# EasyEDA Pro project SMP_Project (2).eprj

# Schematic Schematic1
Board Name: Board1; Create Date: 2026-04-23; Page Name: P1; Project Name: SMP_Project; Schematic Name: Schematic1; Update Date: 2026-04-29; Company: EasyEDA.com; Page Size: A4; Version: V1.0
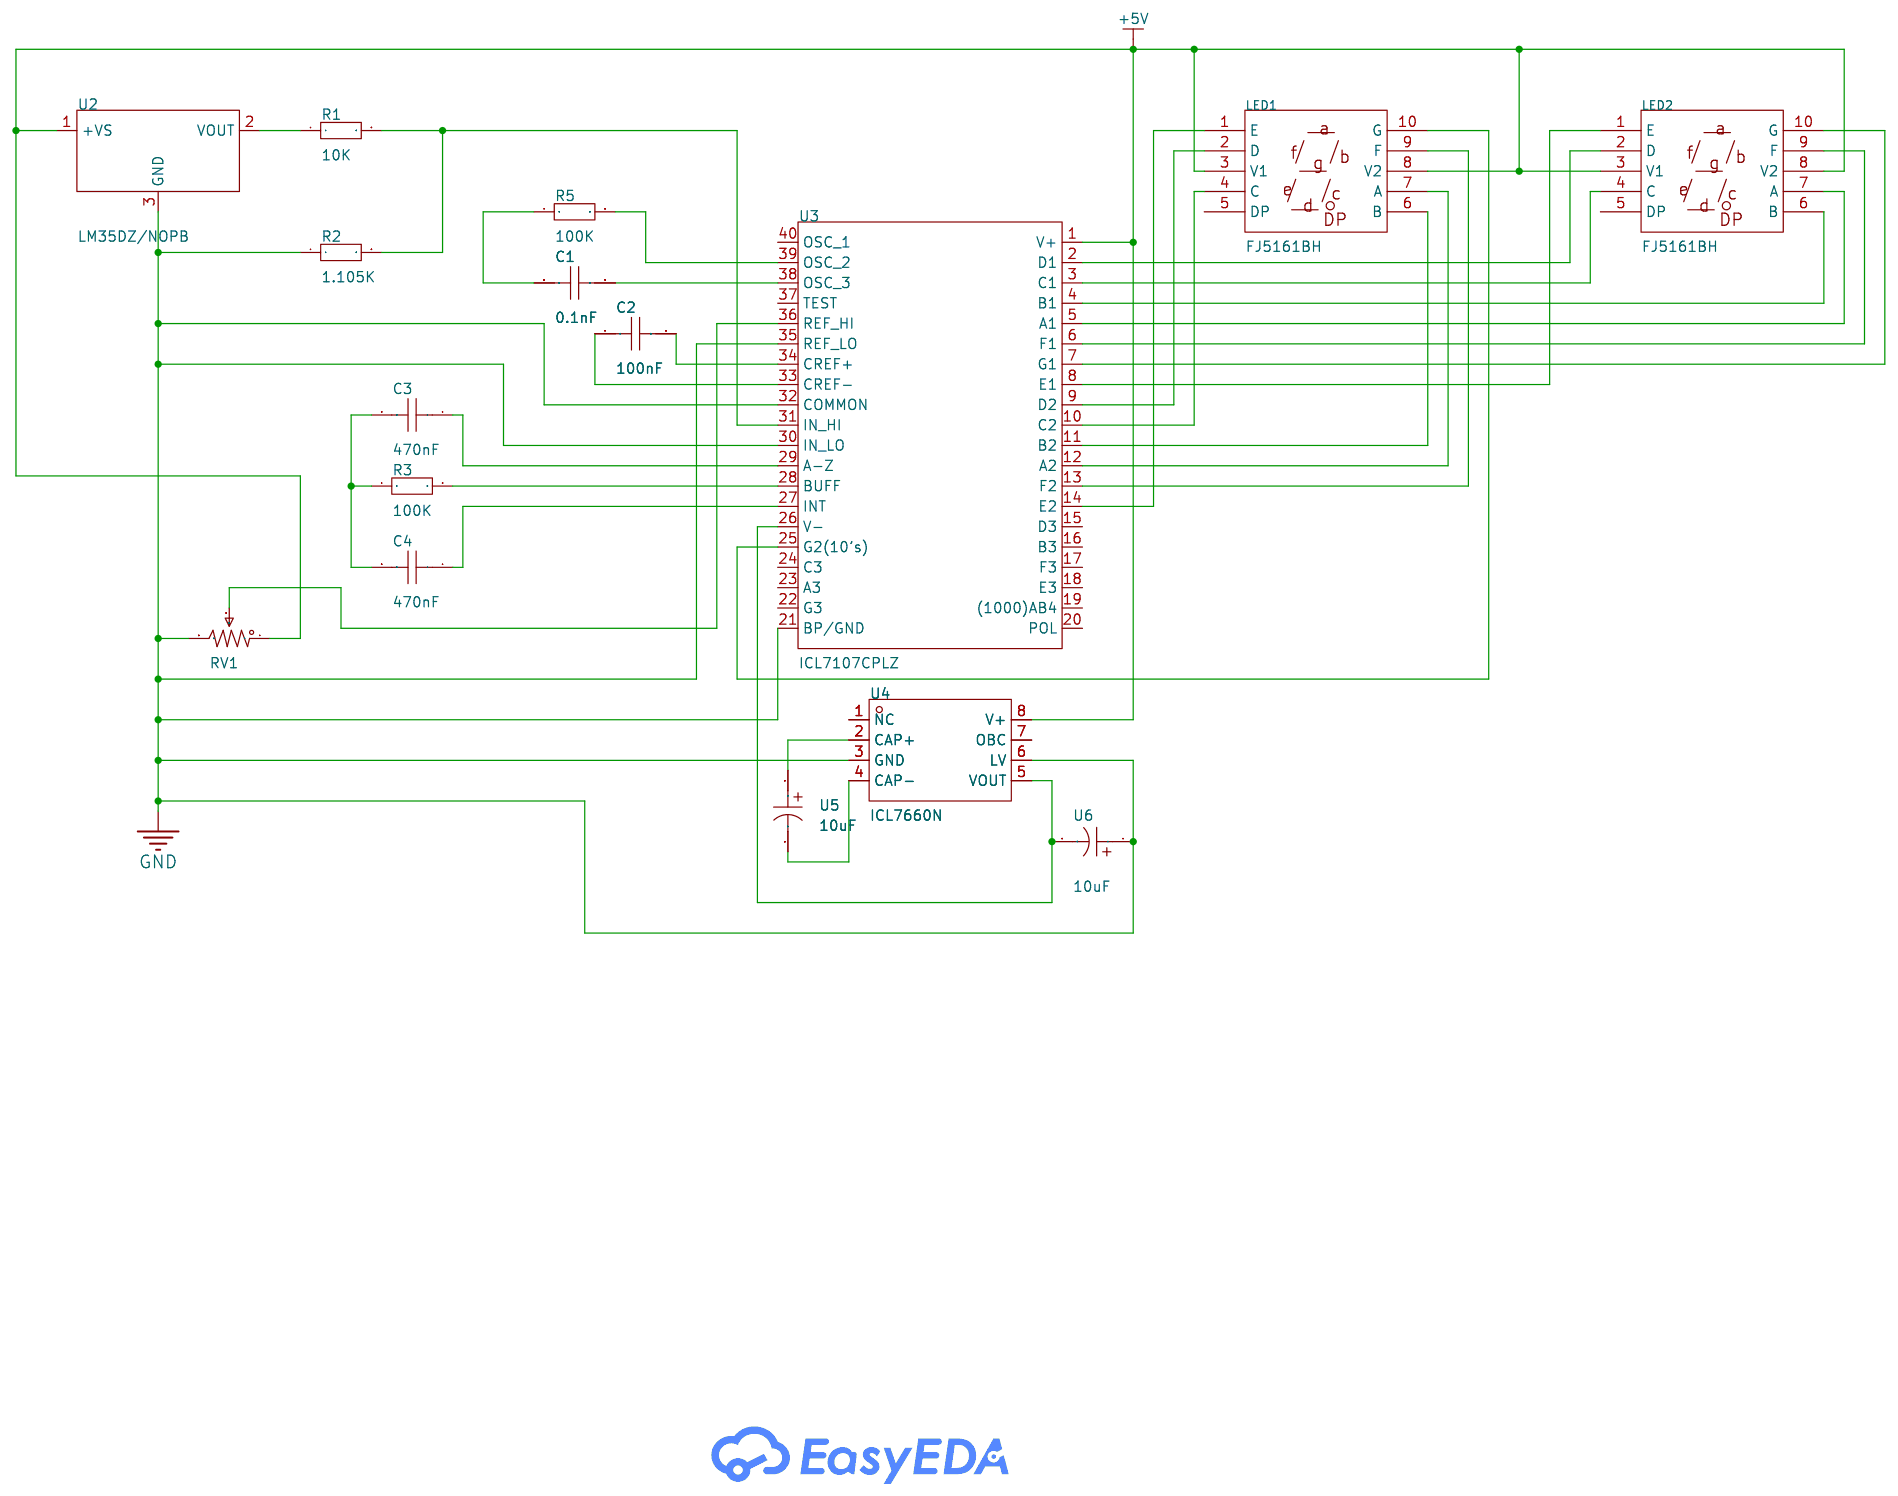
[diagram p0: schematic sheet]

## Parts
C1  0.1nF  [C0805]
C2  100nF  [C0805]
C3  470nF  [C0805]
C4  470nF  [C0805]
LED1  FJ5161BH  [LED-SEG-TH_FJ5161BH]
LED2  FJ5161BH  [LED-SEG-TH_FJ5161BH]
R1  10K  [R0805]
R2  1.105K  [R0805]
R3  100K  [R0805]
R5  100K  [R0805]
RV1  1kΩ  [RES-ADJ-TH_3P-L10.0-W10.0-P2.50-BL-BS]
U2  LM35DZ/NOPB  [TO-92-3_L4.9-W3.7-P1.27-L]
U3  ICL7107CPLZ  [DIP-40_L52.3-W13.9-P2.54-LS15.2-BL]
U4  ICL7660N  [DIP-8_L9.4-W6.4-P2.54-LS9.1-BL]
U5  10uF  [CAP-TH_BD10.0-P5.00-D0.6-FD]
U6  10uF  [CAP-TH_BD10.0-P5.00-D0.6-FD]

## Library data of the parts
C1-C4 = CAP_0805: Supplier Footprint: 0805
LED1 LED2 = FJ5161BH: LCSC Part Name: 1位0.56英寸红色数码管 共阳极; Supplier Part: C8092; Manufacturer: 志浩; Supplier Footprint: 插件; JLCPCB Part Class: Extended Part; Datasheet: https://item.szlcsc.com/datasheet/FJ5161BH/8574.html; Supplier: LCSC; Number of Characters: 1; Display Type: 7 Segment; Digit/Alpha Size(inch): 0.56; Illumination Color: Red; LED Polarity: Common Anode
R1-R3 R5 = Res_0805: Supplier Footprint: 0805
RV1 = 3296W-1-102: LCSC Part Name: 1kΩ ±10%; Supplier Part: C118949; Manufacturer: BOCHEN(博晨); Supplier Footprint: 插件-3P,9.5x4.9mm; JLCPCB Part Class: Extended Part; Datasheet: https://item.szlcsc.com/datasheet/3296W-1-102/120218.html; Supplier: LCSC; Tolerance: ±10%; Power(Watts): 500mW; Temperature Coefficient: ±250ppm/℃; Number of Turns: 30
U2 = LM35DZ/NOPB_C12165: LCSC Part Name: 精密摄氏温度传感器; Supplier Part: C12165; Manufacturer: TI(德州仪器); Supplier Footprint: TO-92; JLCPCB Part Class: Extended Part; Datasheet: https://www.ti.com/cn/lit/gpn/lm35; Supplier: LCSC; Detection Temperature Range: 0℃~+100℃; Tolerance: ±1.5℃; Voltage - Supply: 4V~30V
U3 = ICL7107CPLZ_C1520744: Supplier Part: C1520744; Manufacturer: RENESAS(瑞萨)/IDT; Supplier Footprint: PDIP-40; JLCPCB Part Class: Extended Part; Datasheet: https://item.szlcsc.com/datasheet/ICL7107CPLZ/1611542.html; Supplier: LCSC; Resolution (Bits): 3.5; Voltage - Supply: 6V; Operating Temperature: 0℃~+70℃; Voltage Reference: External；Built-in; Voltage Reference Drift: 1ppm/℃
U4 = ICL7660N: Supplier Part: C19193423; Manufacturer: HGSEMI(华冠); Supplier Footprint: DIP-8; JLCPCB Part Class: Extended Part; Datasheet: https://atta.szlcsc.com/upload/public/pdf/source/20231208/A47A2180530992FCCD2558815FF503B1.pdf; Supplier: LCSC
U5 U6 = 10uF_400V: Supplier Part: C9900016271; Supplier Footprint: Capacitor_THT:CP_Radial_D10.0mm_P5.00mm; JLCPCB Part Class: Extended Part; Supplier: LCSC

## Nets
+5V: LED1.3(V1) LED1.8(V2) LED2.3(V1) LED2.8(V2) RV1.1 U2.1(+VS) U3.1(V+) U4.8(V+)
GND: R2.1 RV1.3 U2.3(GND) U3.21(BP/GND) U3.30(IN LO) U3.32(COMMON) U3.35(REF LO) U4.3(GND) U4.6(LV) U6.1
$1N2817: R1.1 U2.2(VOUT)
$1N5957: R3.2 U3.28(BUFF)
$1N5960: C4.1 U3.27(INT)
$1N5964: C3.2 C4.2 R3.1
$1N6071: C3.1 U3.29(A-Z)
$1N6088: C2.2 U3.34(CREF+)
$1N6111: C2.1 U3.33(CREF-)
$1N6121: R5.2 U3.39(OSC 2)
$1N6127: C1.1 U3.38(OSC 3)
$1N6266: RV1.2 U3.36(REF HI)
$1N6322: LED2.6(B) U3.4(B1)
$1N6356: LED2.2(D) U3.2(D1)
$1N6383: LED2.1(E) U3.8(E1)
$1N6448: LED2.9(F) U3.6(F1)
$1N6454: LED2.10(G) U3.7(G1)
$1N6496: LED1.7(A) U3.12(A2)
$1N6502: LED1.6(B) U3.11(B2)
$1N6516: LED1.4(C) U3.10(C2)
$1N6550: LED1.2(D) U3.9(D2)
$1N6584: LED1.9(F) U3.13(F2)
$1N6616: LED1.1(E) U3.14(E2)
$1N6631: LED1.10(G) U3.25(G2(10’s))
$1N7255: R1.2 R2.2 U3.31(IN HI)
$1N8306: LED2.7(A) U3.5(A1)
$1N8331: LED2.4(C) U3.3(C1)
$1N8679: C1.2 R5.1
$1N8694: U3.26(V-) U4.5(VOUT) U6.2
$1N8864: U4.2(CAP+) U5.1
$1N8870: U4.4(CAP-) U5.2

Not connected (* = marked no-connect by the designer): LED1 5(DP); LED2 5(DP); U3 15(D3) 16(B3) 17(F3) 18(E3) 19((1000)AB4) 20(POL) 22(G3) 23(A3) 24(C3) 37(TEST) 40(OSC 1); U4 1(NC) 7(OBC)

# Board PCB1
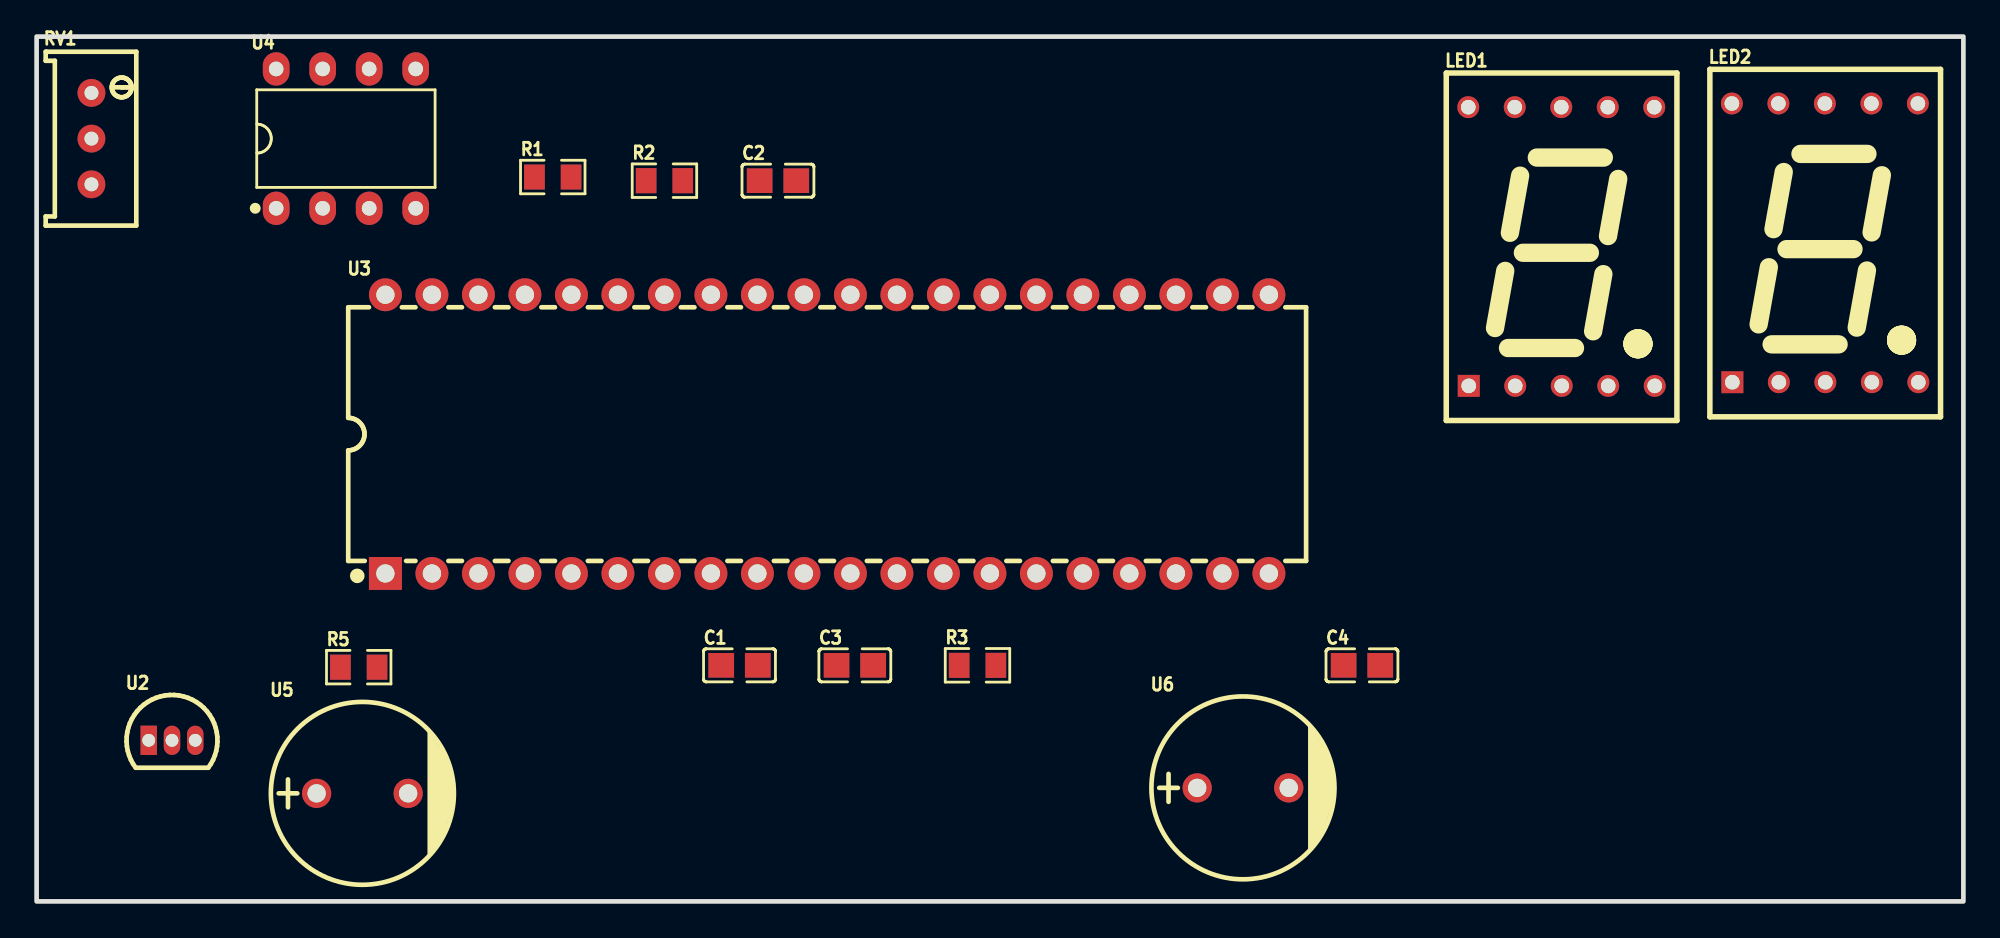
[diagram p1: board, top side]
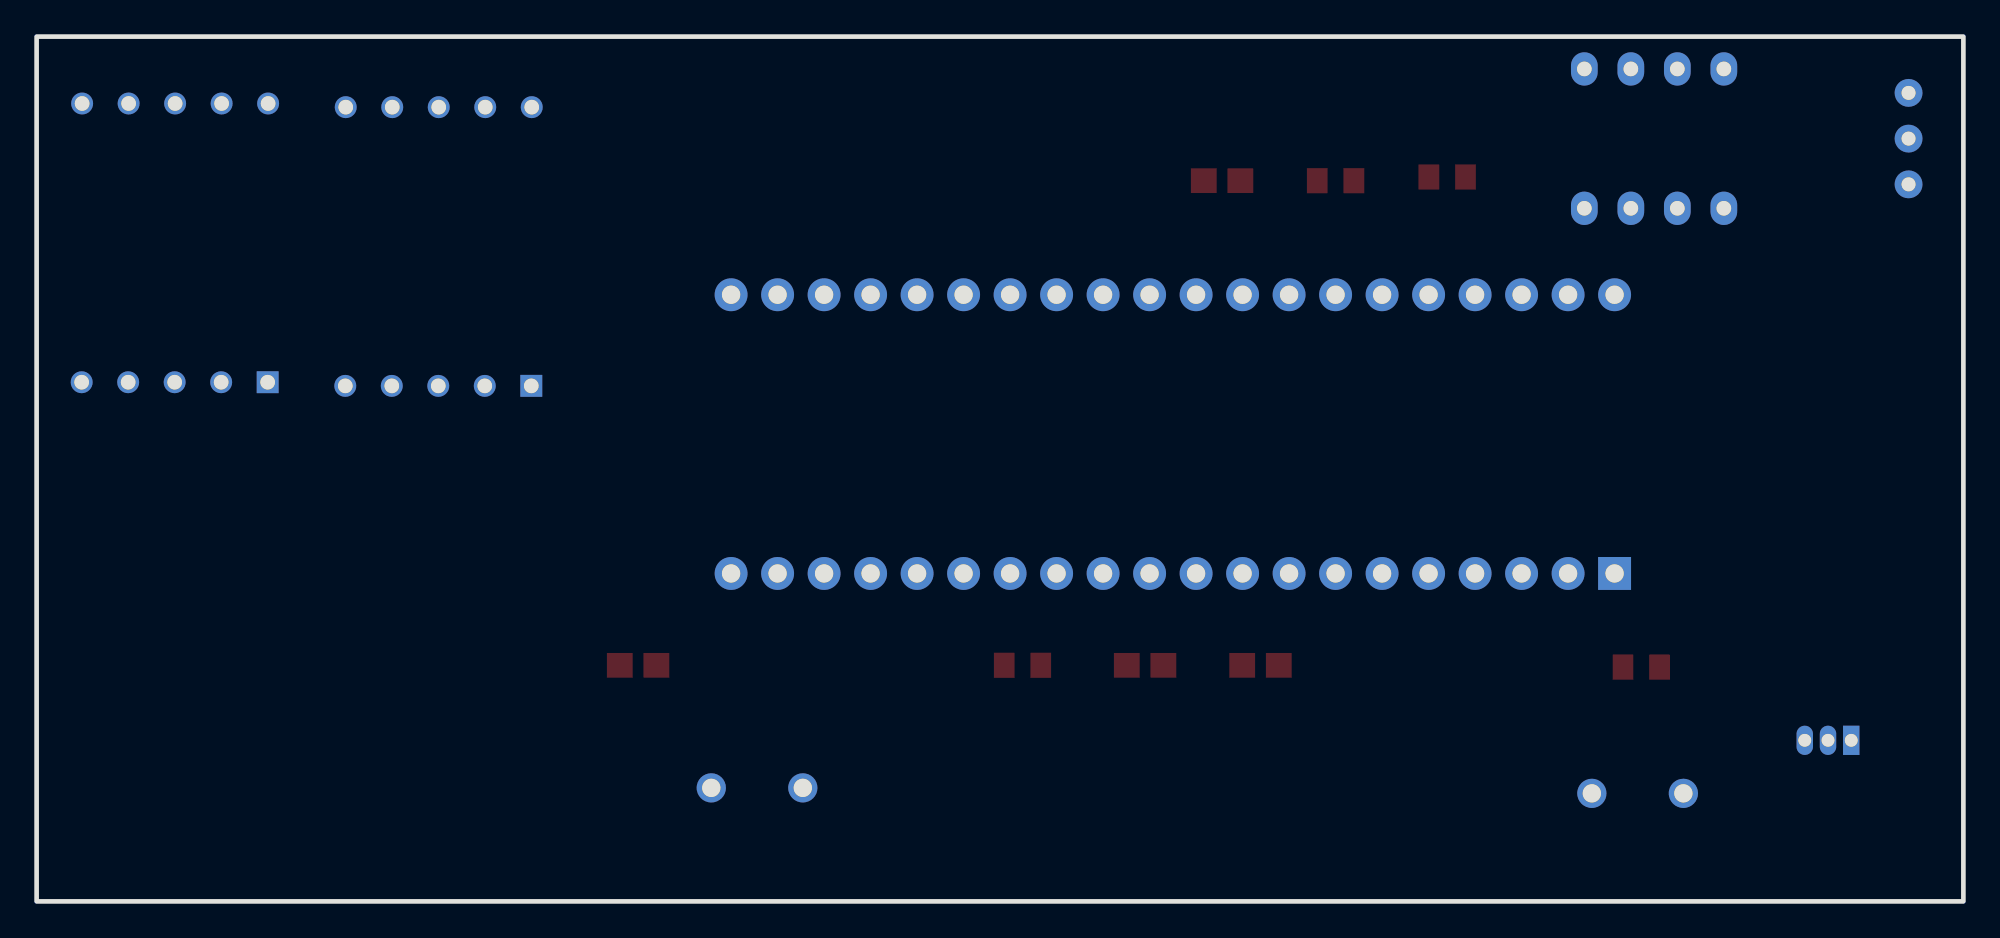
[diagram p2: board, bottom side, seen from below]

Outline 105.25 x 47.29 mm; copper layers: Top Layer, Bottom Layer. Coordinates in mm from the lower left corner of the outline.
Outline path: rectangle 0,47.29 105.25,0
Stack: Top Layer 0.035mm / Dielectric1 1.51mm FR4 er 4.5 / Bottom Layer 0.035mm

## Design rules (mm)
template: JLCPCB Capability(Two Layers Board)
spacing copperThickness1oz (default): track to track 0.102, other pairs 0.152 to 0.3
spacing copperThickness2oz: track to track 0.203, other pairs 0.152 to 0.3
track width copperThickness1oz (default): min 0.127, default 0.254, max 2.54
track width copperThickness2oz: min 0.203, default 0.254, max 2.54
differential pair differentialPair (default): width min 0.127, default 0.254, max 2.54; gap min 0.152, default 0.152
via viaSize (default): diameter min 0.5, default 0.61, max 10; hole min 0.3, default 0.305, max 6.3

## Placement (name value [footprint] x y rotation side)
C1  0.1nF  [C0805]  38.39 12.91 0 top
C2  100nF  [C0805]  40.49 39.41 0 top
C3  470nF  [C0805]  44.7 12.91 0 top
C4  470nF  [C0805]  72.39 12.91 0 top
LED1  FJ5161BH  [LED-SEG-TH_FJ5161BH]  83.3 35.81 0 top
LED2  FJ5161BH  [LED-SEG-TH_FJ5161BH]  97.7 36.01 0 top
R1  10K  [R0805]  28.2 39.61 0 top
R2  1.105K  [R0805]  34.3 39.41 0 top
R3  100K  [R0805]  51.39 12.91 0 top
R5  100K  [R0805]  17.59 12.81 0 top
RV1  1kΩ  [RES-ADJ-TH_3P-L10.0-W10.0-P2.50-BL-BS]  3 41.71 0 top
U2  LM35DZ/NOPB  [TO-92-3_L4.9-W3.7-P1.27-L]  7.39 8.81 0 top
U3  ICL7107CPLZ  [DIP-40_L52.3-W13.9-P2.54-LS15.2-BL]  43.18 25.55 0 top
U4  ICL7660N  [DIP-8_L9.4-W6.4-P2.54-LS9.1-BL]  16.89 41.71 0 top
U5  10uF  [CAP-TH_BD10.0-P5.00-D0.6-FD]  17.8 5.91 0 top
U6  10uF  [CAP-TH_BD10.0-P5.00-D0.6-FD]  65.89 6.21 0 top

## Footprints (pads in the part's own frame, mm; a bottom-side part is the same pattern mirrored in y, then rotated)
C0805
  rect 1.41x1.35 smd: 1(-1,0) 2(1,0)
CAP-TH_BD10.0-P5.00-D0.6-FD
  round 1.6 hole 1: 1(-2.5,0) 2(2.5,0)
DIP-8_L9.4-W6.4-P2.54-LS9.1-BL
  oval 1.46x1.825 hole 0.8: 1(-3.81,-3.81) 2(-1.27,-3.81) 3(1.27,-3.81) 4(3.81,-3.81) 5(3.81,3.81) 6(1.27,3.81) 7(-1.27,3.81) 8(-3.81,3.81)
DIP-40_L52.3-W13.9-P2.54-LS15.2-BL
  rect 1.8x1.8 hole 1: 1(-24.13,-7.62)
  round 1.8 hole 1: 2(-21.59,-7.62) 3(-19.05,-7.62) 4(-16.51,-7.62) 5(-13.97,-7.62) 6(-11.43,-7.62) 7(-8.89,-7.62) 8(-6.35,-7.62) 9(-3.81,-7.62) 10(-1.27,-7.62) 11(1.27,-7.62) 12(3.81,-7.62) 13(6.35,-7.62) 14(8.89,-7.62) 15(11.43,-7.62) 16(13.97,-7.62) 17(16.51,-7.62) 18(19.05,-7.62) 19(21.59,-7.62) 20(24.13,-7.62) 21(24.13,7.62) 22(21.59,7.62) 23(19.05,7.62) 24(16.51,7.62) 25(13.97,7.62) 26(11.43,7.62) 27(8.89,7.62) 28(6.35,7.62) 29(3.81,7.62) 30(1.27,7.62) 31(-1.27,7.62) 32(-3.81,7.62) 33(-6.35,7.62) 34(-8.89,7.62) 35(-11.43,7.62) 36(-13.97,7.62) 37(-16.51,7.62) 38(-19.05,7.62) 39(-21.59,7.62) 40(-24.13,7.62)
LED-SEG-TH_FJ5161BH
  rect 1.2x1.2 hole 0.8: 1(-5.067,-7.62)
  round 1.2 hole 0.8: 2(-2.527,-7.62) 3(0.013,-7.62) 4(2.553,-7.62) 5(5.093,-7.62) 6(5.067,7.62) 7(2.527,7.62) 8(-0.013,7.62) 9(-2.553,7.62) 10(-5.093,7.62)
R0805
  rect 1.133x1.377 smd: 1(-1,0) 2(1,0)
RES-ADJ-TH_3P-L10.0-W10.0-P2.50-BL-BS
  round 1.524 hole 0.762: 1(0,2.5) 2(0,0) 3(0,-2.5)
TO-92-3_L4.9-W3.7-P1.27-L
  rect 0.9x1.6 hole 0.7: 1(-1.27,0)
  oval 0.9x1.6 hole 0.7: 2(0,0) 3(1.27,0)

## Nets
As in the schematic.

Pads without a net: LED1 5; LED2 5; U3 15 16 17 18 19 20 22 23 24 37 40; U4 1 7
